# Altium schematic sheet DS161-1.0-B一氧化碳传感器.SchDoc
size A4; SheetNumber: 1; SheetTotal: 1
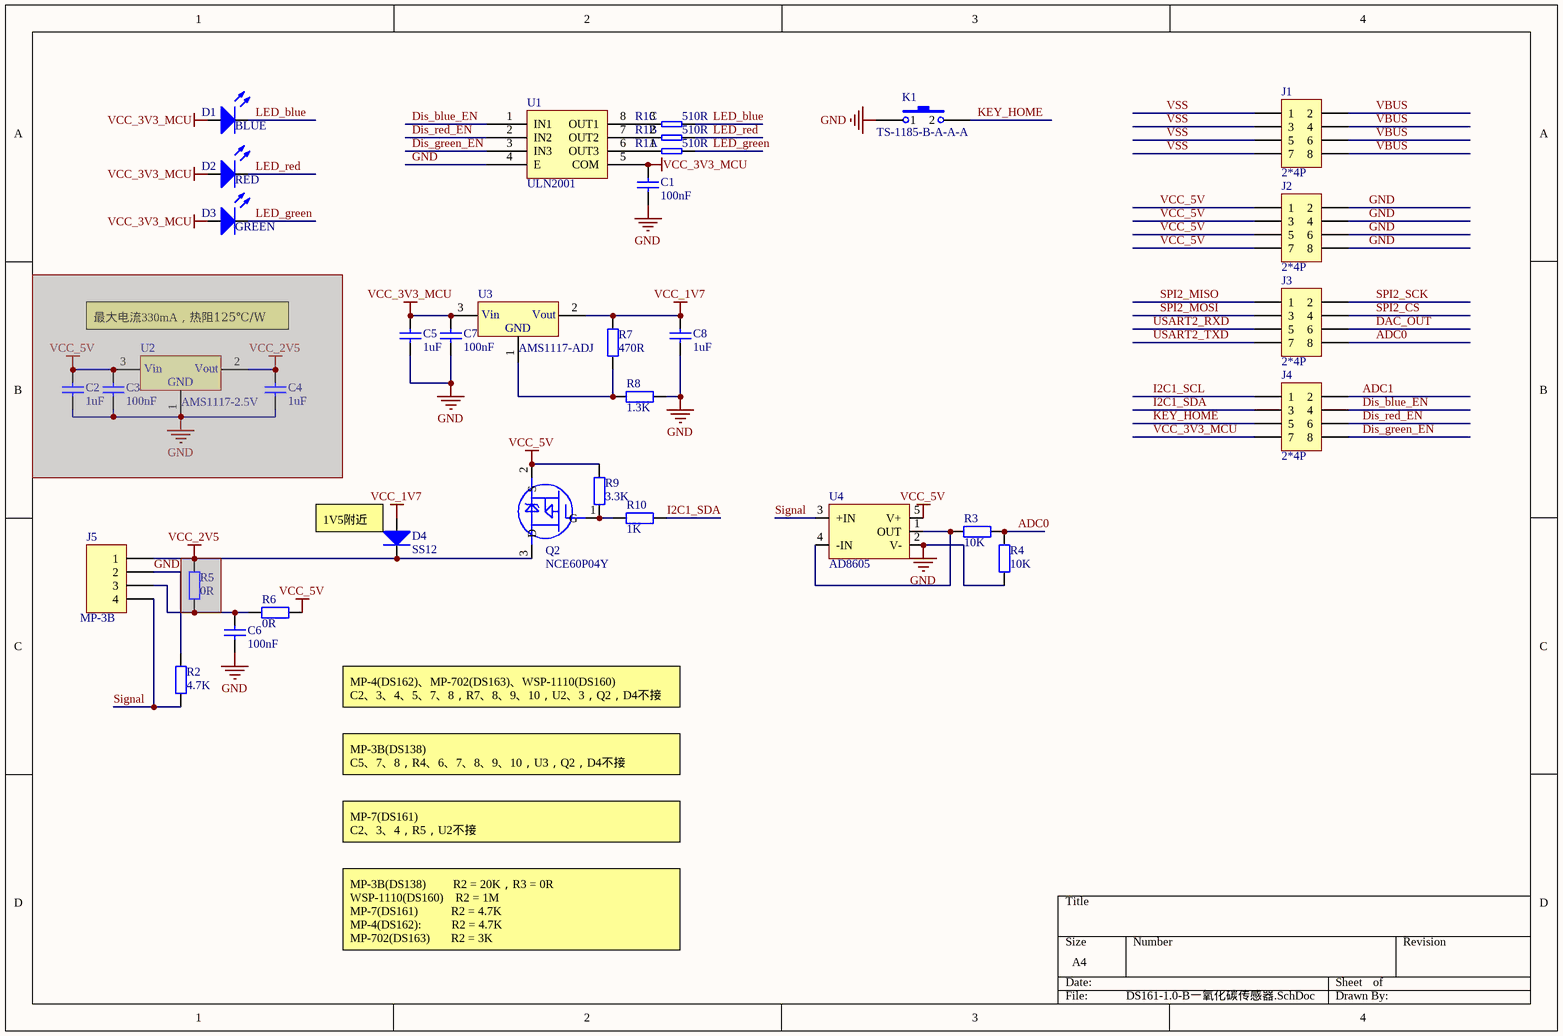
[diagram p0: DS161-1.0-B一氧化碳传感器.SchDoc]

## Parts
C1  value 100nF  [0603CAP]  (hidden comment: SMDCAP00013)
C2  value 1uF  [0603CAP]  (hidden comment: SMDCAP00015)  (masked out: inside a compile mask, not in the netlist)
C3  value 100nF  [0603CAP]  (hidden comment: SMDCAP00013)  (masked out: inside a compile mask, not in the netlist)
C4  value 1uF  [0603CAP]  (hidden comment: SMDCAP00015)  (masked out: inside a compile mask, not in the netlist)
C5  value 1uF  [0603CAP]  (hidden comment: SMDCAP00015)
C6  value 100nF  [0603CAP]  (hidden comment: SMDCAP00013)
C7  value 100nF  [0603CAP]  (hidden comment: SMDCAP00013)
C8  value 1uF  [0603CAP]  (hidden comment: SMDCAP00015)
D1  value BLUE  [LED_0805]  (hidden comment: SMDLED00010)
D2  value RED  [LED_0805]  (hidden comment: SMDLED00003)
D3  value GREEN  [LED_0805]  (hidden comment: Chip 翠绿LED 0805)
D4  value SS12  [SMA/DO-214AC]  (hidden comment: SMDDIODE06003)
J1  value 2*4P  [X1321WVS-2x04J-C40D53]  (hidden comment: X1321WVS-2x04J-C40D53)
J2  value 2*4P  [X1321WVS-2x04J-C40D53]  (hidden comment: X1321WVS-2x04J-C40D53)
J3  value 2*4P  [X1321WVS-2x04J-C40D53]  (hidden comment: X1321WVS-2x04J-C40D53)
J4  value 2*4P  [X1321WVS-2x04J-C40D53]  (hidden comment: X1321WVS-2x04J-C40D53)
J5  value MP-3B  [SIP4]  (hidden comment: SL000000042)
K1  TS-1185-B-A-A-A  [KEY_TS-1185-x-A-A-A]
Q2  NCE60P04Y  [SOT23]
R1  value 510R  [0603RES_Pack4]  (hidden comment: SMDRES05003)  (parts A,B,C of 4)
R2  value 4.7K  [0603RES]  (hidden comment: SMDRES00047)
R3  value 10K  [0603RES]  (hidden comment: SMDRES00056)
R4  value 10K  [0603RES]  (hidden comment: SMDRES00056)
R5  value 0R  [0603RES]  (hidden comment: Chip 0R 1/16W ±1％ 0603)  (masked out: inside a compile mask, not in the netlist)
R6  value 0R  [0603RES]  (hidden comment: Chip 0R 1/16W ±1％ 0603)
R7  value 470R  [0603RES]  (hidden comment: SMDRES00027)
R8  value 1.3K  [0603RES]  (hidden comment: SMDRES00038)
R9  value 3.3K  [0603RES]  (hidden comment: SMDRES00090)
R10  value 1K  [0603RES]  (hidden comment: SMDRES00034)
U1  value ULN2001  [SO-8]  (hidden comment: SMDIC000018)
U2  value AMS1117-2.5V  [SOT223]  (hidden comment: SMDIC000020)  (masked out: inside a compile mask, not in the netlist)
U3  value AMS1117-ADJ  [SOT223]  (hidden comment: SMDIC000020)
U4  AD8605  [SOT23-5]

## Nets
GND: C1.1 C5.1 C6.1 C7.1 C8.1 J2.2 J2.4 J2.6 J2.8 J5.2 K1.1 R2.1 R4.2 R8.2 U1.4(E) U4.2(V-)
VCC_1V7: C8.2 D4.1(A) R7.2 U3.2(Vout)
VCC_3V3_MCU: C1.2 C5.2 C7.2 D1.1(A) D2.1(A) D3.1(A) J4.7 U1.5(COM) U3.3(Vin)
VCC_5V: J2.1 J2.3 J2.5 J2.7 Q2.2(S) R6.1 R9.2 U4.5(V+)
ADC0: J3.8 R3.1 R4.1
ADC1: J4.2
DAC_OUT: J3.6
Dis_blue_EN: J4.4 U1.1(IN1)
Dis_green_EN: J4.8 U1.3(IN3)
Dis_red_EN: J4.6 U1.2(IN2)
I2C1_SCL: J4.1
I2C1_SDA: J4.3 R10.1
KEY_HOME: J4.5 K1.2
LED_blue: D1.2(K) R1.6
LED_green: D3.2(K) R1.8
LED_red: D2.2(K) R1.7
Signal: J5.4 R2.2 U4.3(+IN)
SPI2_CS: J3.4
SPI2_MISO: J3.1
SPI2_MOSI: J3.3
SPI2_SCK: J3.2
USART2_RXD: J3.5
USART2_TXD: J3.7
VBUS: J1.2 J1.4 J1.6 J1.8
VSS: J1.1 J1.3 J1.5 J1.7
NetC6_2: C6.2 J5.3 R6.2
NetD4_2: D4.2(K) J5.1 Q2.3(D)
NetQ2_1: Q2.1(G) R9.1 R10.2
NetR1_1: R1.1 U1.6(OUT3)
NetR1_2: R1.2 U1.7(OUT2)
NetR1_3: R1.3 U1.8(OUT1)
NetR3_2: R3.2 U4.1(OUT) U4.4(-IN)
NetR7_1: R7.1 R8.1 U3.1(GND)

## Notes on the sheet
- 最大电流330mA，热阻125℃/W
- (near D4) 1V5附近
- MP-4(DS162)、MP-702(DS163)、WSP-1110(DS160)
  C2、3、4、5、7、8，R7、8、9、10，U2、3，Q2，D4不接
- MP-3B(DS138)
  C5、7、8，R4、6、7、8、9、10，U3，Q2，D4不接
- MP-7(DS161)
  C2、3、4，R5，U2不接
- MP-3B(DS138)         R2 = 20K，R3 = 0R
  WSP-1110(DS160)    R2 = 1M
  MP-7(DS161)           R2 = 4.7K
  MP-4(DS162):          R2 = 4.7K
  MP-702(DS163)       R2 = 3K

## Library data of the parts
C1 C3 C6 C7 = MLCC 100nF 50V ±10％ 0603: 贴片电容
C2 C4 C5 C8 = MLCC 1uF 50V ±10％ 0603: 贴片电容
D1 = Chip 蓝色LED 0805: 贴片LED
D2 = Chip 红色LED 0805: 贴片LED
D3 = Chip 翠绿LED 0805: 贴片LED
D4 = SS12 SMA/DO-214AC（1N5817）: 贴片肖特基二极管
J1-J4 = X1321WVS-2x04J-C40D53: 双排针2x4P 立贴 1.27mm
J5 = DIP4 单排直针 间距2.54mm 针长11mm 铜
K1 = TS-1185-B-A-A-A: 轻触开关; Value: TS-1185-B-A-A-A
Q2 = NCE60P04Y: P-Channel MOSFET
R1 = Chip R*4 510R 1/16W ±5％ 0603: 贴片排阻
R2 = Chip 4.7K 1/16W ±1％ 0603: 贴片电阻
R3 R4 = Chip 10K 1/16W ±1％ 0603: 贴片电阻
R5 R6 = Chip 0R 1/16W ±1％ 0603: 贴片电阻
R7 = Chip 470R 1/16W ±1％ 0603: 贴片电阻
R8 = Chip 1.3K 1/16W ±1％ 0603: 贴片电阻
R9 = Chip 3.3K 1/16W ±1％ 0603: 贴片电阻
R10 = Chip 1K 1/16W ±1％ 0603: 贴片电阻
U1 = ULN2001 SOP-8: 电机驱动芯片
U2 U3 = AMS1117-3.3V SOT-223: 稳压芯片
U4 = AD8605 SOT23-5: 运放芯片